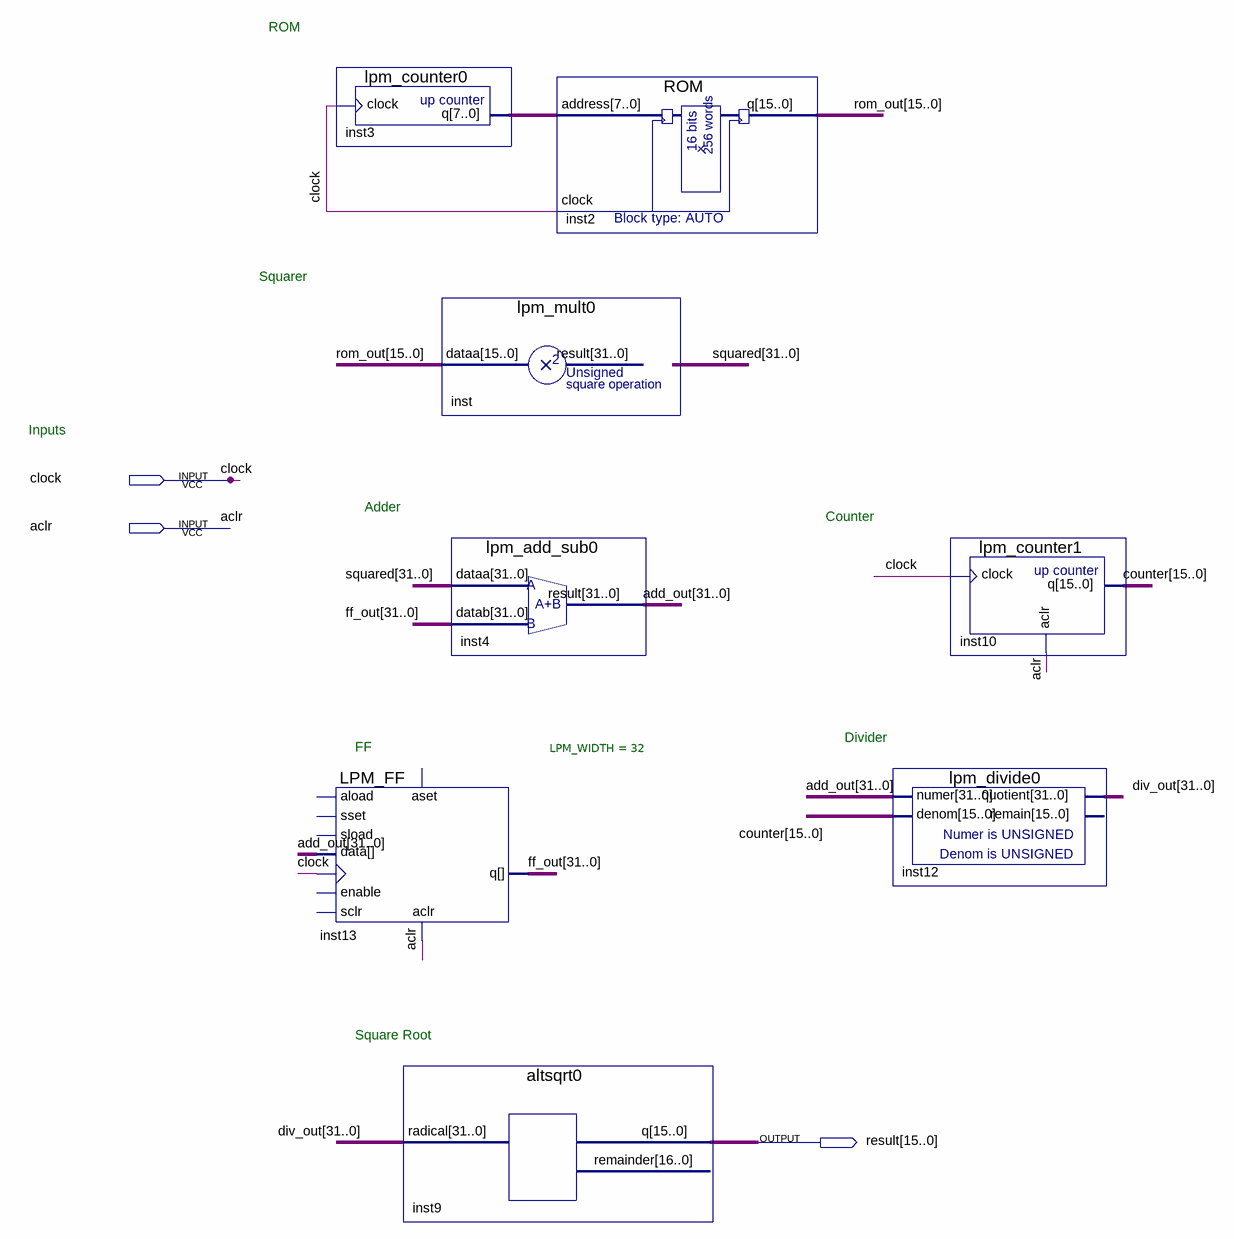
[diagram p0: schematic sheet]
// Quartus schematic RootMeanSquare.bdf as structural Verilog: 8 symbols, 3 pins
module RootMeanSquare (
  input  clock,
  input  aclr,
  output [15:0] result
);

  wire [7:0] inst3_q;
  wire [15:0] counter, rom_out;
  wire [31:0] add_out, div_out, ff_out, squared;

  lpm_counter0 inst3 (.clock(clock), .q(inst3_q));
  LPM_FF #(.LPM_WIDTH(32)) inst13 (
    .clock(clock), .aclr(aclr), .data(add_out), .q(ff_out));  // open: enable, aload, sset, sload, aset, sclr
  lpm_mult0 inst (.dataa(rom_out), .result(squared));
  lpm_add_sub0 inst4 (.dataa(squared), .datab(ff_out), .result(add_out));
  altsqrt0 inst9 (.radical(div_out), .q(result));  // open: remainder
  ROM inst2 (.address(inst3_q), .clock(clock), .q(rom_out));
  lpm_divide0 inst12 (.numer(add_out), .denom(counter), .quotient(div_out));  // open: remain
  lpm_counter1 inst10 (.clock(clock), .aclr(aclr), .q(counter));

  // Notes on the sheet:
  //   ROM
  //   Squarer
  //   Inputs
  //   Adder
  //   Counter
  //   Divider
  //   FF
  //   Square Root
endmodule
